# Altium schematic sheet Protolink USB V1.SchDoc
size A4
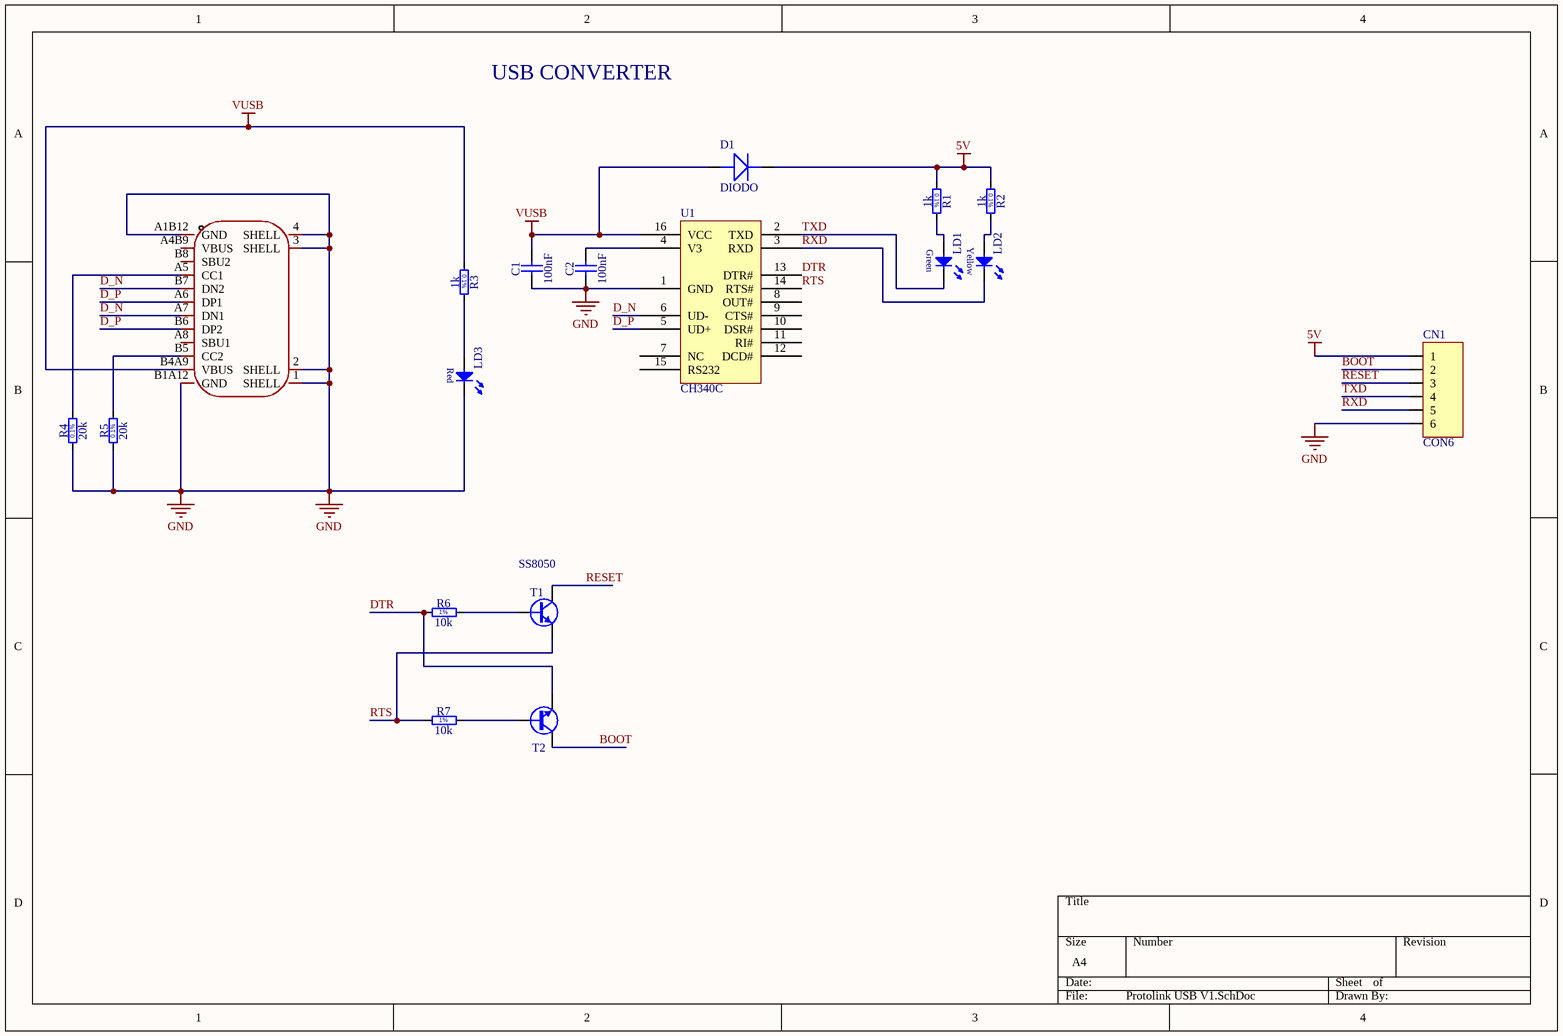
[diagram p0: Protolink USB V1.SchDoc]

## Parts
C1  100nF  [CAPC2012X135N]
C2  100nF  [CAPC2012X135N]
CN1  CON6  [PIN6_RIGHT_ANGLE]
D1  DIODO  [DIODE_SMA]
LD1  Green  [LED_OSRAM_LGR971]  (value not drawn)
LD2  Yellow  [LED_OSRAM_LYR976]  (value not drawn)
LD3  Super Red  [LED_OSRAM_LSR976]  (value not drawn)
R1  1k  [RESC2012X60N]
R2  1k  [RESC2012X60N]
R3  1k  [RESC2012X60N]
R4  20k  [RESC2012X60N]
R5  20k  [RESC2012X60N]
R6  10k  [RESC2012X60N]
R7  10k  [RESC2012X60N]
T1  MMBT3904  [SOT95P230X110-3N]  (value not drawn)
T2  MMBT3904  [SOT95P230X110-3N]  (value not drawn)
U1  CH340C  [SOIC-16_N]
U2  GT-USB-7010ASV  [USB-C-SMD_G-SWITCH_GT-USB-7010ASV]  (value not drawn)

## Nets
5V: CN1.1 D1.1 R1.1 R2.1
GND: C1.1 C2.1 CN1.6 LD3.1(C) R4.1 R5.1 U1.1(GND) U2.1(SHELL) U2.2(SHELL) U2.3(SHELL) U2.4(SHELL) U2.A1B12(GND) U2.B1A12(GND)
VUSB: C1.2 D1.2 R3.1 U1.16(VCC) U2.B4A9(VBUS)
BOOT: CN1.2 T2.3(C)
D_N: U1.6(UD-) U2.A7(DN1) U2.B7(DN2)
D_P: U1.5(UD+) U2.A6(DP1) U2.B6(DP2)
DTR: R6.1 T2.2(E) U1.13(DTR#)
RESET: CN1.3 T1.3(C)
RTS: R7.1 T1.2(E) U1.14(RTS#)
RXD: CN1.5 LD2.1(C) U1.3(RXD)
TXD: CN1.4 LD1.1(C) U1.2(TXD)
NetC2_2: C2.2 U1.4(V3)
NetLD1_2: LD1.2(A) R1.2
NetLD2_2: LD2.2(A) R2.2
NetLD3_2: LD3.2(A) R3.2
NetR4_2: R4.2 U2.A5(CC1)
NetR5_2: R5.2 U2.B5(CC2)
NetR6_2: R6.2 T1.1(B)
NetR7_2: R7.2 T2.1(B)

Not connected (* = marked no-connect by the designer): U1 7(NC) 8(OUT#) 9(CTS#) 10(DSR#) 11(RI#) 12(DCD#) 15(RS232); U2 A4B9(VBUS) A8(SBU1) B8(SBU2)

## Notes on the sheet
- USB CONVERTER
- (near T1) SS8050
- (in symbol LED_OSRAM_LSR976) Red
- (in symbol R0805_1K0_0.1%_0.1W_10PPM) 0.1%
- (in symbol R0805_10K_1%_0.125W_100PPM) 1%
- (in symbol R0805_20K_0.1%_0.1W_10PPM) 0.1%

## Library data of the parts
C1 C2 = CC0805_100NF_50V_10%_X7R: Non-polarised capacitor; Part Description: SMD Multilayer Chip Ceramic Capacitor; Manufacturer: GENERIC; Manufacturer1 Part Number: B37941K5104K62; Voltage: 50V; TC: X7R; Tolerance: ±10%; Table: Capacitors SMD; Part Number: CC0805_100NF_50V_10%_X7R; Component Kind: Standard; Component Type: Standard; Pin Count: 2; Value: 100nF; Status: Preferred; Manufacturer Part Number: CC0805_100NF_50V_10%_X7R; Case: 0805; Mounted: Yes; Socket: No; SMD: Yes; Manufacturer1 Example: EPCOS; Manufacturer1 ComponentHeight: 1.35mm; HelpURL: \\cern.ch\dfs\Applications\Altium\Datasheets\CC0805_X7R_EPCOS.pdf; Author: CERN DEM JLC; CreateDate: 03/12/2007; LatestRevisionDate: 03/12/2007
LD1 = LED_OSRAM_LGR971: LED Green 1C 2A; Part Description: Surface Mount Green LED (0805 Case); Manufacturer: OSRAM; Manufacturer Part Number: LGR971; Table: LEDs & Displays; Part Number: LED_OSRAM_LGR971; Component Kind: Standard; Component Type: Standard; Color: Green; PackageDescription: Green Chip LED, 2-Leads, Body 2.0x1.25mm, IPC Medium Density; Pin Count: 2; Case: 0805; Mounted: Yes; Socket: No; SMD: Yes; ComponentHeight: 0.9mm; HelpURL: \\cern.ch\dfs\Applications\Altium\Datasheets\LED_OSRAM_LGR971.pdf; Author: CERN DEM JLC; CreateDate: 28/01/2009; LatestRevisionDate: 17/03/2010
LD2 = LED_OSRAM_LYR976: LED Yellow 1C 2A; Part Description: Surface Mount Yellow LED (0805 Case); Manufacturer: OSRAM; Manufacturer Part Number: LYR976; Table: LEDs & Displays; Part Number: LED_OSRAM_LYR976; Component Kind: Standard; Component Type: Standard; Color: Yellow; PackageDescription: Yellow Chip LED, 2-Leads, Body 2 x1.25mm, IPC Medium Density; Pin Count: 2; Case: 0805; Mounted: Yes; Socket: No; SMD: Yes; ComponentHeight: 0.9mm; HelpURL: \\cern.ch\dfs\Applications\Altium\Datasheets\LED_OSRAM_LYR976.pdf; Author: CERN DEM JLC; CreateDate: 18/05/2010; LatestRevisionDate: 18/05/2010
LD3 = LED_OSRAM_LSR976: LED Red 1C 2A; Part Description: Surface Mount Super Red LED (0805 Case); Manufacturer: OSRAM; Manufacturer Part Number: LSR976; Table: LEDs & Displays; Part Number: LED_OSRAM_LSR976; Component Kind: Standard; Component Type: Standard; Color: Super Red; PackageDescription: Super Red Chip LED, 2-Leads, Body 2 x1.25mm, IPC Medium Density; Pin Count: 2; Case: 0805; Mounted: Yes; Socket: No; SMD: Yes; ComponentHeight: 0.9mm; HelpURL: \\cern.ch\dfs\Applications\Altium\Datasheets\LED_OSRAM_LSR976.pdf; Author: CERN DEM JLC; CreateDate: 18/05/2010; LatestRevisionDate: 18/05/2010
R1-R3 = R0805_1K0_0.1%_0.1W_10PPM: Resistor - 0.1%; Part Description: Thin Film Chip Resistor; Manufacturer: GENERIC; Manufacturer1 Part Number: RN73C2A1K0BTG; Power: 0.1W; TC: ±10ppm; Table: Resistors SMD; Part Number: R0805_1K0_0.1%_0.1W_10PPM; Component Kind: Standard; Component Type: Standard; Pin Count: 2; Value: 1k; Status: Not recommended; Tolerance: ±0.1%; Manufacturer Part Number: R0805_1K0_0.1%_0.1W_10PPM; Case: 0805; Mounted: Yes; Socket: No; SMD: Yes; Manufacturer1 Example: TYCO HOLSWORTHY; Manufacturer1 ComponentHeight: 0.6mm; HelpURL: \\cern.ch\dfs\Applications\Altium\Datasheets\R0805_Tyco_RN73.pdf; Author: CERN DEM JLC; CreateDate: 03/12/2007; LatestRevisionDate: 13/03/2008
R4 R5 = R0805_20K_0.1%_0.1W_10PPM: Resistor - 0.1%; Part Description: Thin Film Chip Resistor; Manufacturer: GENERIC; Manufacturer1 Part Number: RN73C2A20KBTG; Power: 0.1W; TC: ±10ppm; Table: Resistors SMD; Part Number: R0805_20K_0.1%_0.1W_10PPM; Component Kind: Standard; Component Type: Standard; Pin Count: 2; Value: 20k; Status: Not recommended; Tolerance: ±0.1%; Manufacturer Part Number: R0805_20K_0.1%_0.1W_10PPM; Case: 0805; Mounted: Yes; Socket: No; SMD: Yes; Manufacturer1 Example: TYCO HOLSWORTHY; Manufacturer1 ComponentHeight: 0.6mm; HelpURL: \\cern.ch\dfs\Applications\Altium\Datasheets\R0805_Tyco_RN73.pdf; Author: CERN DEM JLC; CreateDate: 03/12/2007; LatestRevisionDate: 13/03/2008
R6 R7 = R0805_10K_1%_0.125W_100PPM: Resistor - 1%; Part Description: General Purpose Thick Film Chip Resistor; Manufacturer: GENERIC; Manufacturer1 Part Number: NRC10F1002TRF; Power: 0.125W; TC: ±100ppm/°C; Table: Resistors SMD; Part Number: R0805_10K_1%_0.125W_100PPM; Component Kind: Standard; Component Type: Standard; Pin Count: 2; Value: 10k; Status: Preferred; Tolerance: ±1%; Manufacturer Part Number: R0805_10K_1%_0.125W_100PPM; Case: 0805; Mounted: Yes; Socket: No; SMD: Yes; Manufacturer1 Example: NIC COMPONENT; Manufacturer1 ComponentHeight: 0.6mm; HelpURL: \\cern.ch\dfs\Applications\Altium\Datasheets\R0805_NIC_NRC.pdf; Author: CERN DEM JLC; CreateDate: 03/12/2007; LatestRevisionDate: 13/03/2008
T1 T2 = MMBT3904: NPN Transistor; Part Description: 40V 200mA NPN Switching Transistor; Manufacturer: NXP SEMICONDUCTORS; Table: Transistors; Part Number: MMBT3904; Component Kind: Standard; Component Type: Standard; Device: MMBT3904; PackageDescription: SOT23, 3 pin, Pitch 0.95mm - 1.3mm W X 2.9mm L X 1.1mm H, IPC Medium Density; Manufacturer Part Number: MMBT3904; Pin Count: 3; Case: SOT23-3; Mounted: Yes; Socket: No; SMD: Yes; ComponentHeight: 1.1mm; HelpURL: \\cern.ch\dfs\Applications\Altium\Datasheets\MMBT3904.pdf; Author: CERN DEM JLC; CreateDate: 10/02/2010; LatestRevisionDate: 10/02/2010
U2 = GT-USB-7010ASV: Manufacturer: G-Switch(品赞); Add into BOM: yes; Connector Type: Type-C; Gender: Female; Number of Contacts: 16P; Number of Ports: 1; Current Rating - Power (Max): 3A; Rated Voltage (Max): 24V; Connect-Disconnect Life: 10,000 times; Center Height: 1.68mm; Core Colour: Black; Symbol: GT-USB-7010ASV; Device: GT-USB-7010ASV; LCSC Part Name: Type-C 母 卧贴; Supplier Part: C2988369; Manufacturer Part: GT-USB-7010ASV; Supplier Footprint: SMD; JLCPCB Part Class: Extended Part; Datasheet: https://atta.szlcsc.com/upload/public/pdf/source/20230327/DF227B64686AC8FA0AD1775797F2C3F1.pdf; Supplier: LCSC; Convert to PCB: yes; Standard: USB 2.0; Mounting Style: Horizontal attachment; Length: 7.35mm; Operating Temperature Range: -40℃~+85℃